# Altium project SynchroLightMaster_V2.PrjPcb
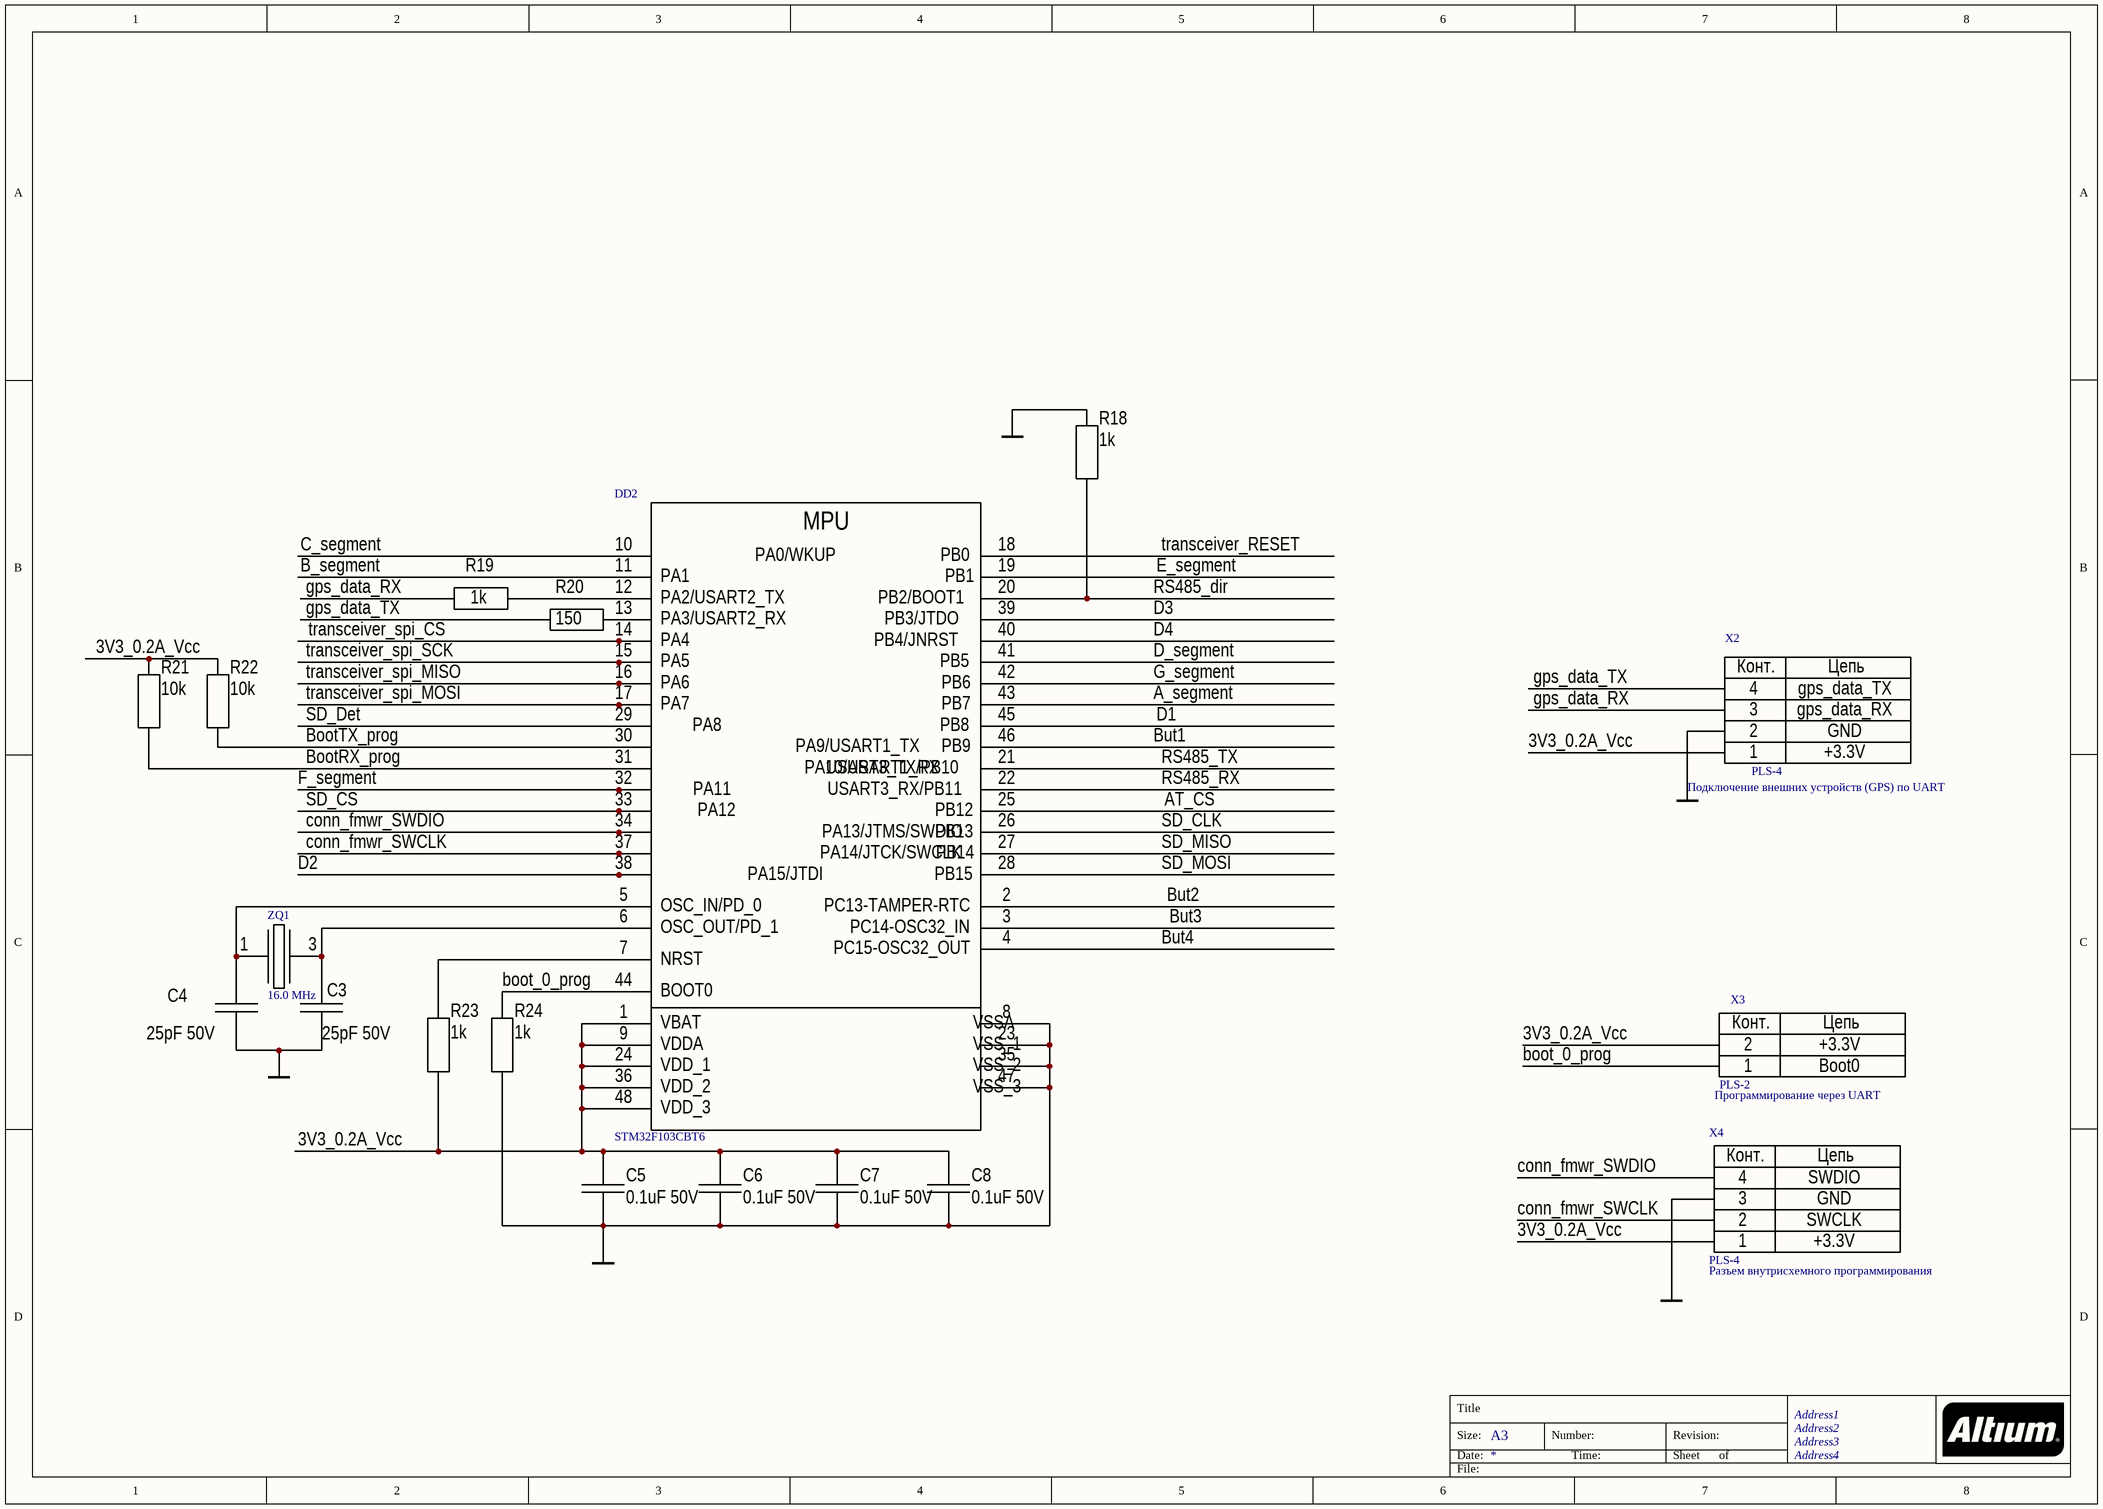
[diagram p0: MCU.SchDoc]
5 sheets, 116 parts. Net scope: global (net labels, ports and power ports of the same name join across sheets).
Board file: SynchroLightMaster_V2.PcbDoc
Sheets:
  MCU.SchDoc
  Transceiver.SchDoc
  RS485_USB.SchDoc
  LCD_SD.SchDoc
  Power.SchDoc

## Sheet MCU.SchDoc
size A3; Address1: Address1; Address2: Address2; Address3: Address3; Address4: Address4

### Parts
C3  25pF 50V  [0805_CAP]
C4  25pF 50V  [0805_CAP]
C5  0.1uF 50V  [0805_CAP]
C6  0.1uF 50V  [0805_CAP]
C7  0.1uF 50V  [0805_CAP]
C8  0.1uF 50V  [0805_CAP]
DD2  STM32F103CBT6  [Lqfp-48]
R18  1k  [0805_RES]
R19  1k  [0805_RES]
R20  150  [0805_RES]
R21  10k  [0805_RES]
R22  10k  [0805_RES]
R23  1k  [0805_RES]
R24  1k  [0805_RES]
X2  PLS-4  Destiny: Подключение внешних устройств (GPS) по UART  [PLS-4-2.54]
X3  PLS-2  Destiny: Программирование через UART  [PLS-2-2.54]
X4  PLS-4  Destiny: Разъем внутрисхемного программирования  [PLS-4-2.54]
ZQ1  16.0 MHz  [HC-49]

### Nets
GND: C3.1 C4.1 C5.1 C6.1 C7.1 C8.1 DD2.8 DD2.23 DD2.35 DD2.47 R18.2 R24.1 X2.2 X4.3
3V3_0.2A_Vcc: C5.2 C6.2 C7.2 C8.2 DD2.1 DD2.9 DD2.24 DD2.36 DD2.48 R21.2 R22.2 R23.1 X2.1 X3.2 X4.1
A_segment: DD2.43
AT_CS: DD2.25
B_segment: DD2.11
boot_0_prog: DD2.44 R24.2 X3.1
BootRX_prog: DD2.31 R21.1
BootTX_prog: DD2.30 R22.1
But1: DD2.46
But2: DD2.2
But3: DD2.3
But4: DD2.4
C_segment: DD2.10
conn_fmwr_SWCLK: DD2.37 X4.2
conn_fmwr_SWDIO: DD2.34 X4.4
D1: DD2.45
D2: DD2.38
D3: DD2.39
D4: DD2.40
D_segment: DD2.41
E_segment: DD2.19
F_segment: DD2.32
G_segment: DD2.42
gps_data_RX: R19.2 X2.3
gps_data_TX: R20.2 X2.4
RS485_dir: DD2.20 R18.1
RS485_RX: DD2.22
RS485_TX: DD2.21
SD_CLK: DD2.26
SD_CS: DD2.33
SD_Det: DD2.29
SD_MISO: DD2.27
SD_MOSI: DD2.28
transceiver_RESET: DD2.18
transceiver_spi_CS: DD2.14
transceiver_spi_MISO: DD2.16
transceiver_spi_MOSI: DD2.17
transceiver_spi_SCK: DD2.15
NetC3_2: C3.2 DD2.6 ZQ1.3
NetC4_2: C4.2 DD2.5 ZQ1.1
NetDD2_7: DD2.7 R23.2
NetDD2_12: DD2.12 R19.1
NetDD2_13: DD2.13 R20.1

### Notes on the sheet
- Title
- Size:
- Date:
- A3
- Number:
- Time:
- Revision:
- Sheet
- of
- File:
- (in symbol 2pin_conn) Конт.; Цепь
- (in symbol 4pin_conn) Конт.; Цепь
- (in symbol STM32F103-48) MPU; PA0/WKUP; PB0; PA1; PB1; PA2/USART2_TX; PB2/BOOT1; PA3/USART2_RX; PB3/JTDO; PA4; PB4/JNRST; PA5; PB5; PA6; PB6; PA7; PB7; PA8; PB8; PA9/USART1_TX; PB9; PA10/USART1_RX; USART3_TX/PB10; PA11; USART3_RX/PB11; PA12; PB12; PA13/JTMS/SWDIO; PB13; PA14/JTCK/SWCLK; PB14; PA15/JTDI; PB15; OSC_IN/PD_0; PC13-TAMPER-RTC; OSC_OUT/PD_1; PC14-OSC32_IN; PC15-OSC32_OUT; NRST; BOOT0; VBAT; VSSA; VDDA; VSS_1; VDD_1; VSS_2; VDD_2; VSS_3; VDD_3

### Library data of the parts
C3-C8 = Cap_np
  C3 C4: Value: 25pF 50V
  C5-C8: Value: 0.1uF 50V
DD2 = STM32F103-48: Value: STM32F103CBT6
R18-R24 = Res
  R18 R19 R23 R24: Value: 1k
  R20: Value: 150
  R21 R22: Value: 10k
X2 = 4pin_conn: PinName1: +3.3V; PinName2: GND; PinName3: gps_data_RX; PinName4: gps_data_TX; Value: PLS-4
X3 = 2pin_conn: PinName2: +3.3V; PinName1: Boot0; Value: PLS-2
X4 = 4pin_conn: PinName1: +3.3V; PinName2: SWCLK; PinName3: GND; PinName4: SWDIO; Value: PLS-4
ZQ1 = Cristall: Value: 16.0 MHz

## Sheet Transceiver.SchDoc
size A3; Address1: Address1; Address2: Address2; Address3: Address3; Address4: Address4
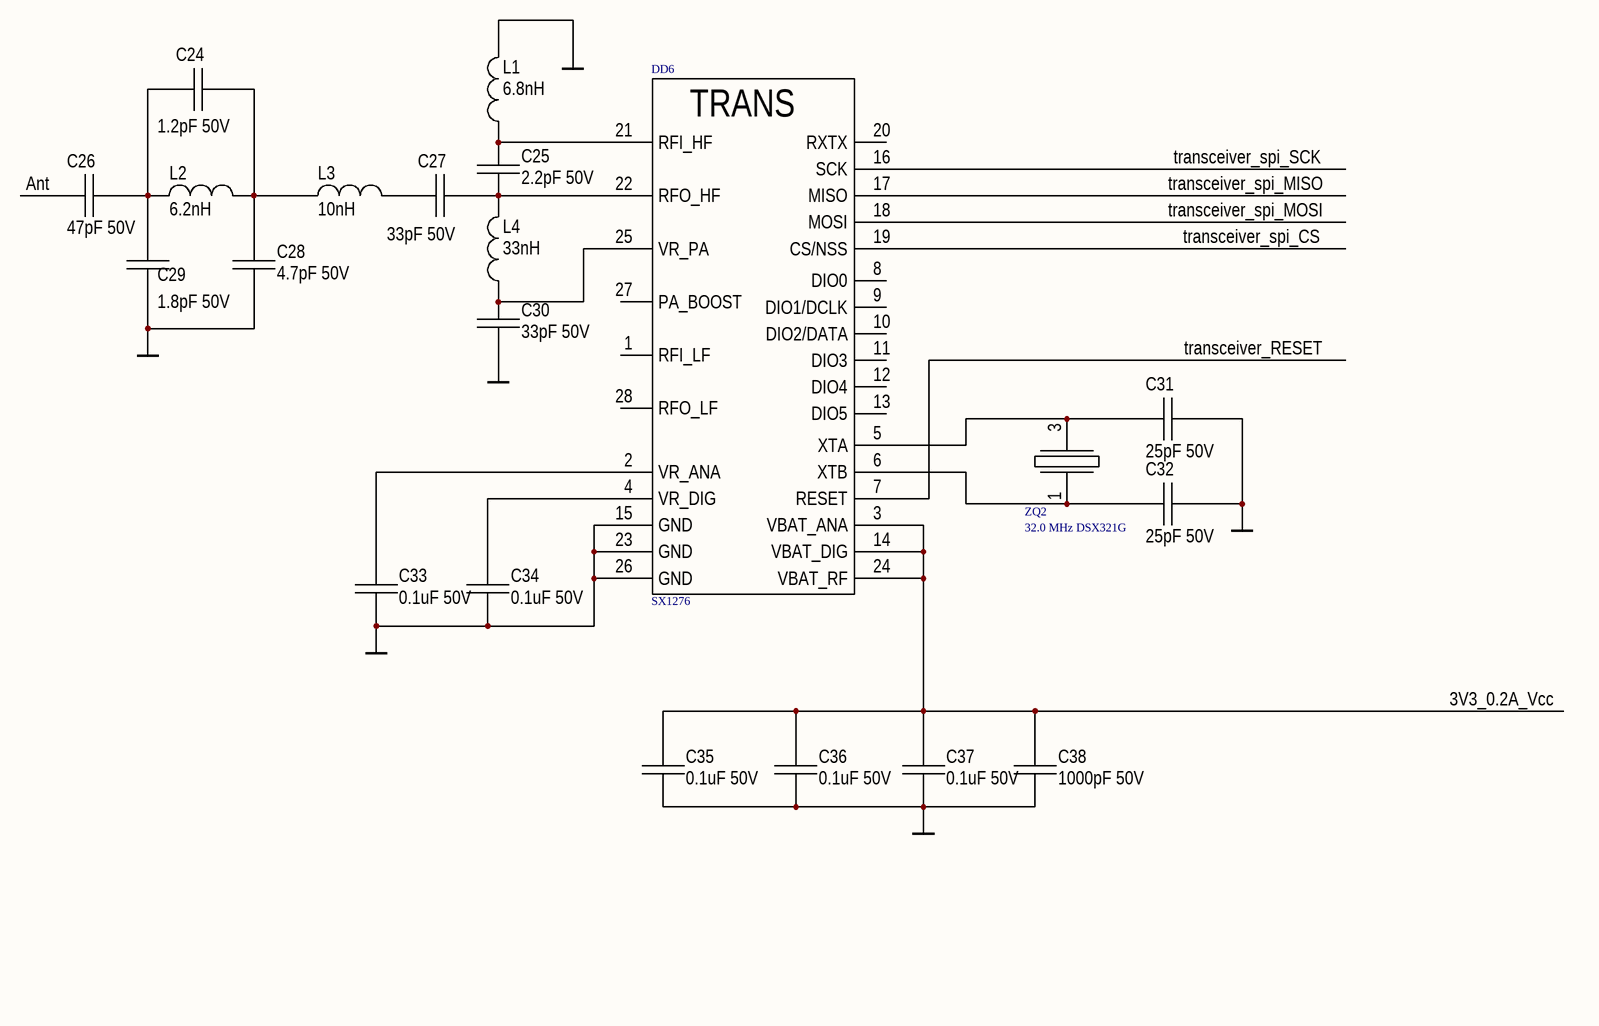
[diagram p1: Transceiver.SchDoc]

### Parts
C24  1.2pF 50V  [0603_CAP]
C25  2.2pF 50V  [0603_CAP]
C26  47pF 50V  [0603_CAP]
C27  33pF 50V  [0603_CAP]
C28  4.7pF 50V  [0603_CAP]
C29  1.8pF 50V  [0603_CAP]
C30  33pF 50V  [0603_CAP]
C31  25pF 50V  [0805_CAP]
C32  25pF 50V  [0805_CAP]
C33  0.1uF 50V  [0805_CAP]
C34  0.1uF 50V  [0805_CAP]
C35  0.1uF 50V  [0805_CAP]
C36  0.1uF 50V  [0805_CAP]
C37  0.1uF 50V  [0805_CAP]
C38  1000pF 50V  [0805_CAP]
DD6  SX1276  [qfn28]
L1  6.8nH  [0603_ind]
L2  6.2nH  [0603_ind]
L3  10nH  [0603_ind]
L4  33nH  [0603_ind]
ZQ2  32.0 MHz DSX321G  [gtxo-93]

### Nets
GND: C28.2 C29.1 C30.2 C31.2 C32.2 C33.1 C34.2 C35.2 C36.2 C37.2 C38.2 DD6.15(GND) DD6.23(GND) DD6.26(GND) L1.2
3V3_0.2A_Vcc: C35.1 C36.1 C37.1 C38.1 DD6.3(VBAT_ANA) DD6.14(VBAT_DIG) DD6.24(VBAT_RF)
Ant: C26.2
transceiver_RESET: DD6.7(RESET)
transceiver_spi_CS: DD6.19(CS/NSS)
transceiver_spi_MISO: DD6.17(MISO)
transceiver_spi_MOSI: DD6.18(MOSI)
transceiver_spi_SCK: DD6.16(SCK)
NetC24_1: C24.1 C26.1 C29.2 L2.1
NetC24_2: C24.2 C28.1 L2.2 L3.1
NetC25_1: C25.1 C27.1 DD6.22(RFO_HF) L4.2
NetC25_2: C25.2 DD6.21(RFI_HF) L1.1
NetC27_2: C27.2 L3.2
NetC30_1: C30.1 DD6.25(VR_PA) L4.1
NetC31_1: C31.1 DD6.5(XTA) ZQ2.3
NetC32_1: C32.1 DD6.6(XTB) ZQ2.1
NetC33_2: C33.2 DD6.2(VR_ANA)
NetC34_1: C34.1 DD6.4(VR_DIG)

Not connected (* = marked no-connect by the designer): DD6 1(RFI_LF) 8(DIO0) 9(DIO1/DCLK) 10(DIO2/DATA) 11(DIO3) 12(DIO4) 13(DIO5) 20(RXTX) 27(PA_BOOST) 28(RFO_LF)

### Notes on the sheet
- На место компонента С6 запаивается перемычка
- Title
- Size:
- Date:
- A3
- Number:
- Time:
- Revision:
- Sheet
- of
- File:
- (in symbol SX1276) TRANS

### Library data of the parts
C24-C38 = Cap_np
  C24: Value: 1.2pF 50V
  C25: Value: 2.2pF 50V
  C26: Value: 47pF 50V
  C27 C30: Value: 33pF 50V
  C28: Value: 4.7pF 50V
  C29: Value: 1.8pF 50V
  C31 C32: Value: 25pF 50V
  C33-C37: Value: 0.1uF 50V
  C38: Value: 1000pF 50V
L1-L4 = Inductor
  L1: Value: 6.8nH
  L2: Value: 6.2nH
  L3: Value: 10nH
  L4: Value: 33nH
ZQ2 = Cristall: Value: 32.0 MHz DSX321G
DD6 = SX1276: Value: SX1276

## Sheet RS485_USB.SchDoc
size A3; Address1: Address1; Address2: Address2; Address3: Address3; Address4: Address4
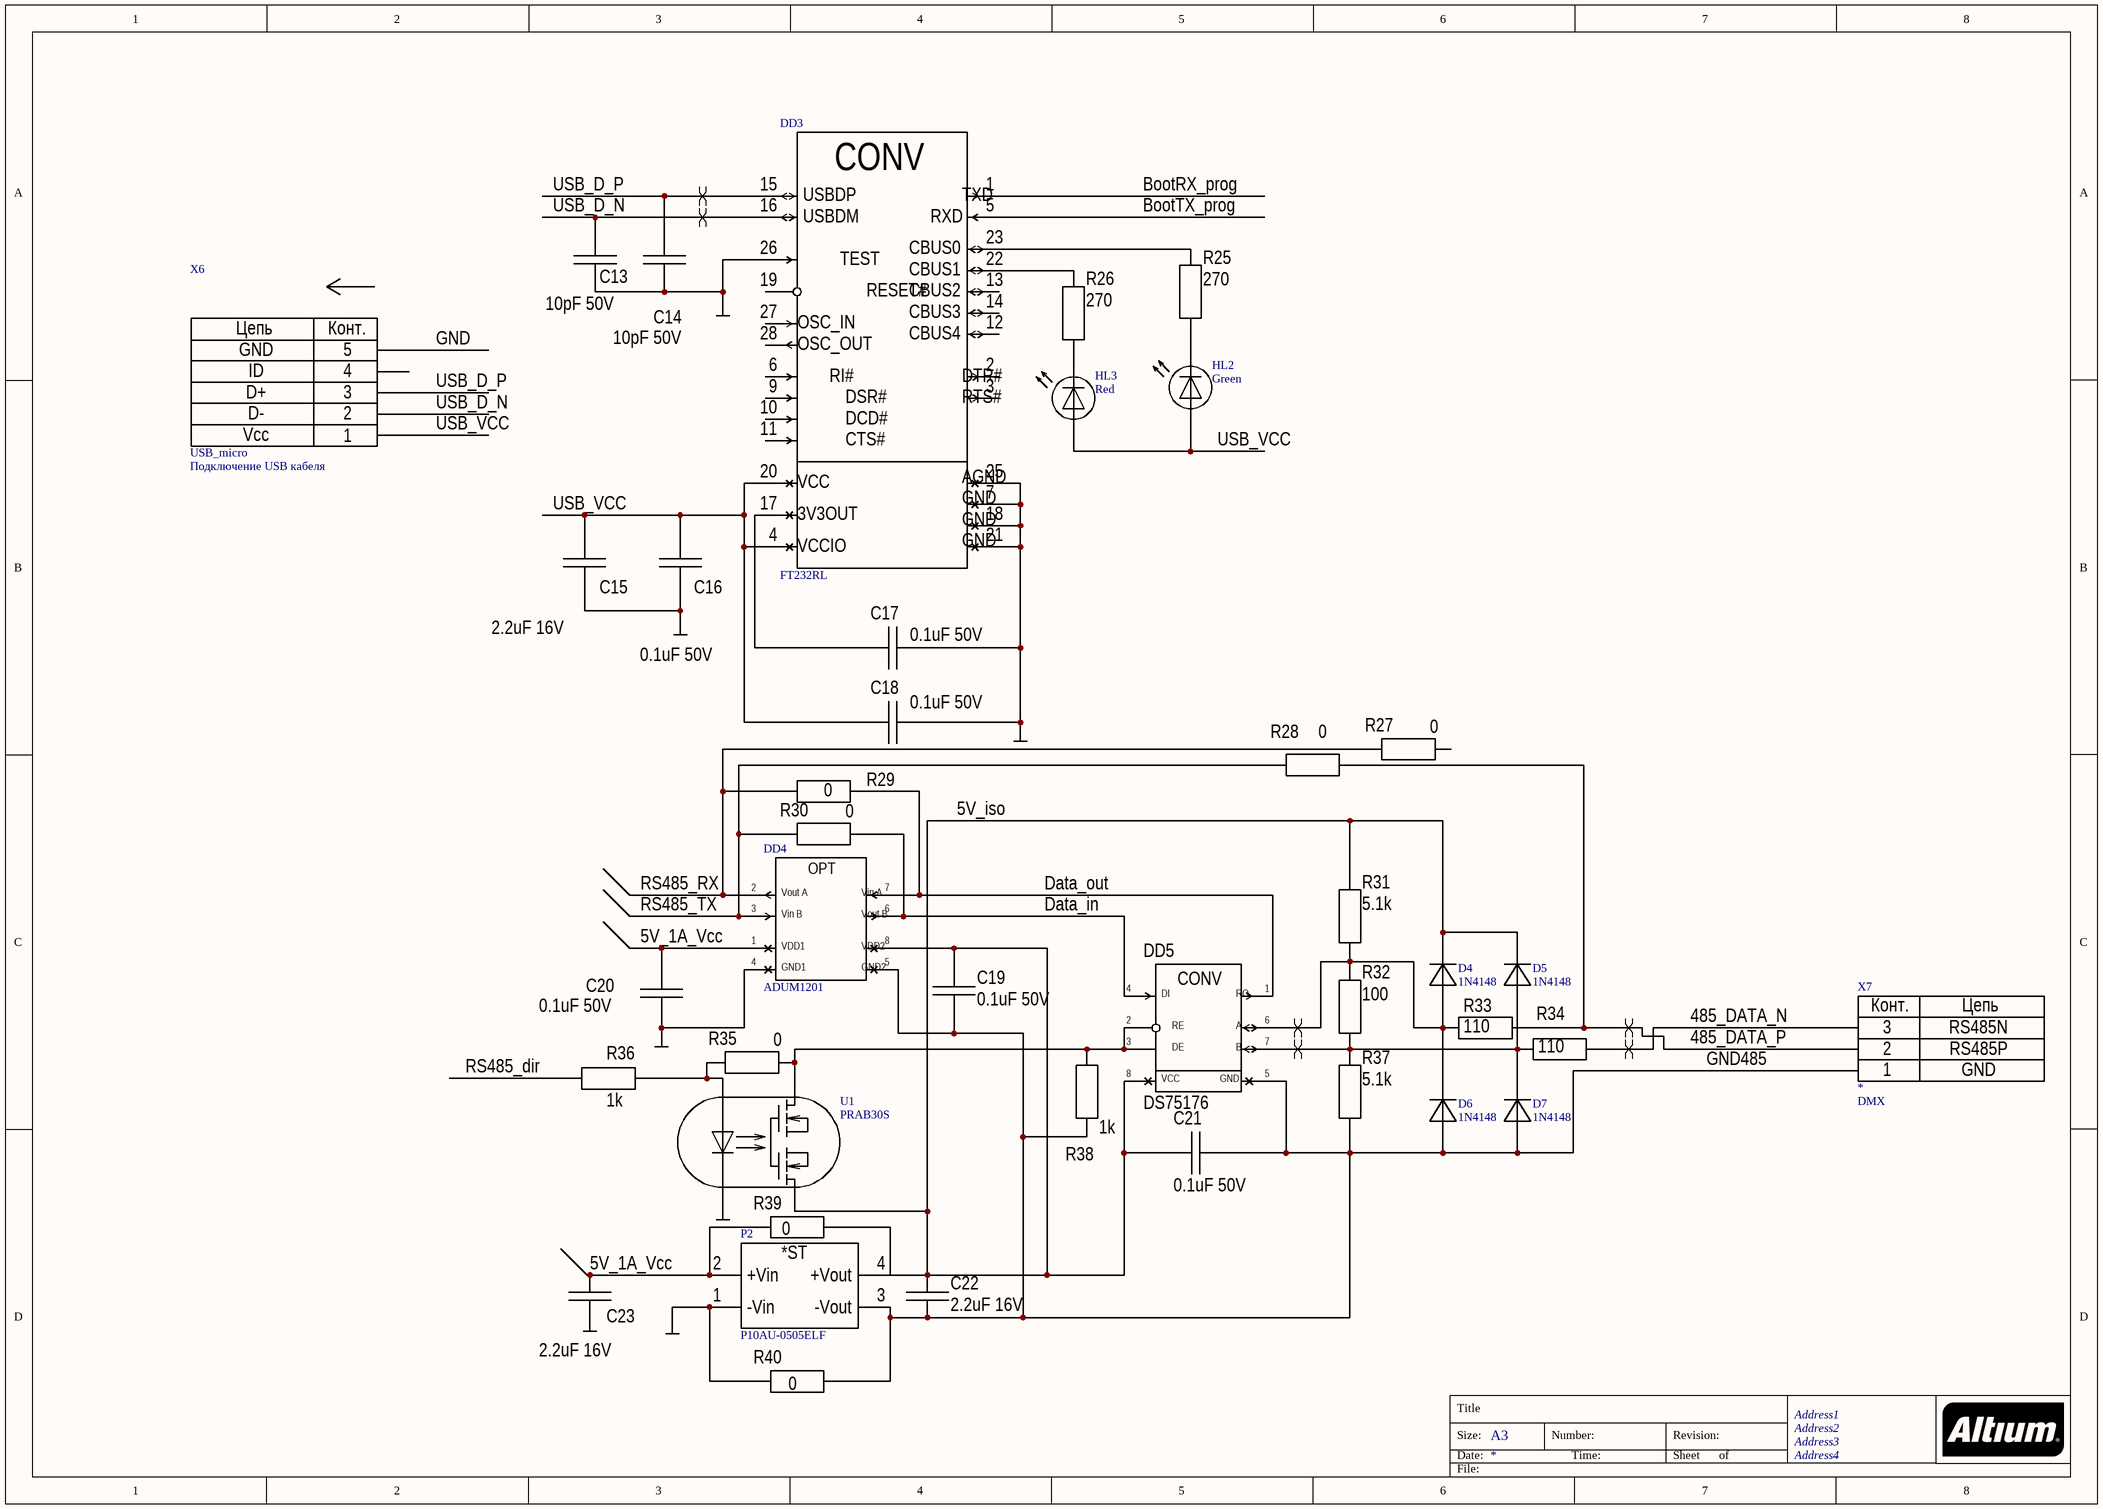
[diagram p2: RS485_USB.SchDoc]

### Parts
C13  10pF 50V  [0805_CAP]
C14  10pF 50V  [0805_CAP]
C15  2.2uF 16V  [0805_CAP]
C16  0.1uF 50V  [0805_CAP]
C17  0.1uF 50V  [0805_CAP]
C18  0.1uF 50V  [0805_CAP]
C19  0.1uF 50V  [0805_CAP]
C20  0.1uF 50V  [0805_CAP]
C21  0.1uF 50V  [0805_CAP]
C22  2.2uF 16V  [0805_CAP]
C23  2.2uF 16V  [0805_CAP]
D4  1N4148  [sod80c]
D5  1N4148  [sod80c]
D6  1N4148  [sod80c]
D7  1N4148  [sod80c]
DD3  FT232RL  [SSOP28]
DD4  ADUM1201  [soic-8]
DD5  DS75176  [soic-8]
HL2  Green  [0603_led_ipc]
HL3  Red  [0603_led_ipc]
P2  P10AU-0505ELF  [SIP4]
R25  270  [0805_RES]
R26  270  [0805_RES]
R27  0  [0805_RES]
R28  0  [0805_RES]
R29  0  [0805_RES]
R30  0  [0805_RES]
R31  5.1k  [0805_RES]
R32  100  [0805_RES]
R33  110  [0805_RES]
R34  110  [0805_RES]
R35  0  [0805_RES]
R36  1k  [0805_RES]
R37  5.1k  [0805_RES]
R38  1k  [0805_RES]
R39  0  [0805_RES]
R40  0  [0805_RES]
U1  PRAB30S  [sop4_optocoup]
X6  USB_micro  Назначение: Подключение USB кабеля  [usb_micro]
X7  *  Destiny: DMX  [3pad_5.08]

### Nets
GND: C13.1 C14.1 C15.1 C16.1 C17.1 C18.1 C20.2 C23.1 DD3.7 DD3.18 DD3.21 DD3.25 DD3.26 DD4.4 P2.1(-Vin) R40.1 U1.2(C) X6.5
5V_1A_Vcc: C20.1 C23.2 DD4.1(A1) P2.2(+Vin) R39.1
5V_iso: C19.1 C21.1 C22.2 D4.2 D5.2 DD4.8 DD5.8 P2.4(+Vout) R31.1 R39.2 U1.3(E)
485_DATA_N: R34.2 X7.3
485_DATA_P: R28.2 R33.2 X7.2
BootRX_prog: DD3.1
BootTX_prog: DD3.5
Data_in: DD4.6 DD5.4 R30.2
Data_out: DD4.7 DD5.1 R29.2
GND485: C19.2 C21.2 C22.1 D6.1 D7.1 DD4.5 DD5.5 P2.3(-Vout) R37.2 R38.2 R40.2 X7.1
RS485_dir: R36.1
RS485_RX: DD4.2 R27.1 R29.1
RS485_TX: DD4.3 R28.1 R30.1
USB_D_N: C13.2 DD3.16 X6.2
USB_D_P: C14.2 DD3.15 X6.3
USB_VCC: C15.2 C16.2 C18.2 DD3.4 DD3.20 HL2.1 HL3.1 X6.1
NetC17_2: C17.2 DD3.17
NetD4_1: D4.1 D6.2 DD5.6 R31.2 R32.1 R33.1
NetD5_1: D5.1 D7.2 DD5.7 R32.2 R34.1 R37.1
NetDD3_22: DD3.22 R26.2
NetDD3_23: DD3.23 R25.2
NetDD5_2: DD5.2 DD5.3 R35.2 R38.1 U1.4(C)
NetHL2_2: HL2.2 R25.1
NetHL3_2: HL3.2 R26.1
NetR35_1: R35.1 R36.2 U1.1(A)

Not connected (* = marked no-connect by the designer): DD3 2 3 6 9 10 11 12 13 14 19 27 28; R27 2; X6 4

### Layout directives
differential pair: 485_DATA_N, 485_DATA_P, NetD4_1, NetD5_1, USB_D_N, USB_D_P

### Notes on the sheet
- Title
- Size:
- Date:
- A3
- Number:
- Time:
- Revision:
- Sheet
- of
- File:
- (in symbol 3pin_conn) Конт.; Цепь
- (in symbol ADUM1201) OPT; Vout A; Vin A; Vin B; Vout B; VDD1; VDD2; GND1; GND2
- (in symbol ds75176) CONV; DI; RO; RE; A; DE; B; VCC; GND
- (in symbol FT232RL) CONV; USBDP; TXD; USBDM; RXD; CBUS0; TEST; CBUS1; RESET#; CBUS2; CBUS3; OSC_IN; CBUS4; OSC_OUT; RI#; DTR#; DSR#; RTS#; DCD#; CTS#; VCC; AGND; GND; 3V3OUT; VCCIO
- (in symbol P10AU) *ST
- (in symbol USB_micro) Цепь; Конт.; GND; ID; D+; D-; Vcc

### Library data of the parts
C13-C23 = Cap_np
  C13 C14: Value: 10pF 50V
  C15 C22 C23: Value: 2.2uF 16V
  C16-C21: Value: 0.1uF 50V
D4-D7 = Diode: Value: 1N4148
HL2 HL3 = led
  HL2: Value: Green
  HL3: Value: Red
P2 = P10AU: Value: P10AU-0505ELF
R25-R40 = Res
  R25 R26: Value: 270
  R27-R30 R35 R39 R40: Value: 0
  R31 R37: Value: 5.1k
  R32: Value: 100
  R33 R34: Value: 110
  R36 R38: Value: 1k
U1 = Opto_Realy: Value: PRAB30S
X7 = 3pin_conn: PinName1: GND; PinName2: RS485P; PinName3: RS485N; Value: *
DD3 = FT232RL: Value: FT232RL
DD4 = ADUM1201: Value: ADUM1201
DD5 = ds75176: Value: DS75176
X6 = USB_micro: Value: USB_micro

## Sheet LCD_SD.SchDoc
size A3; Address1: Address1; Address2: Address2; Address3: Address3; Address4: Address4
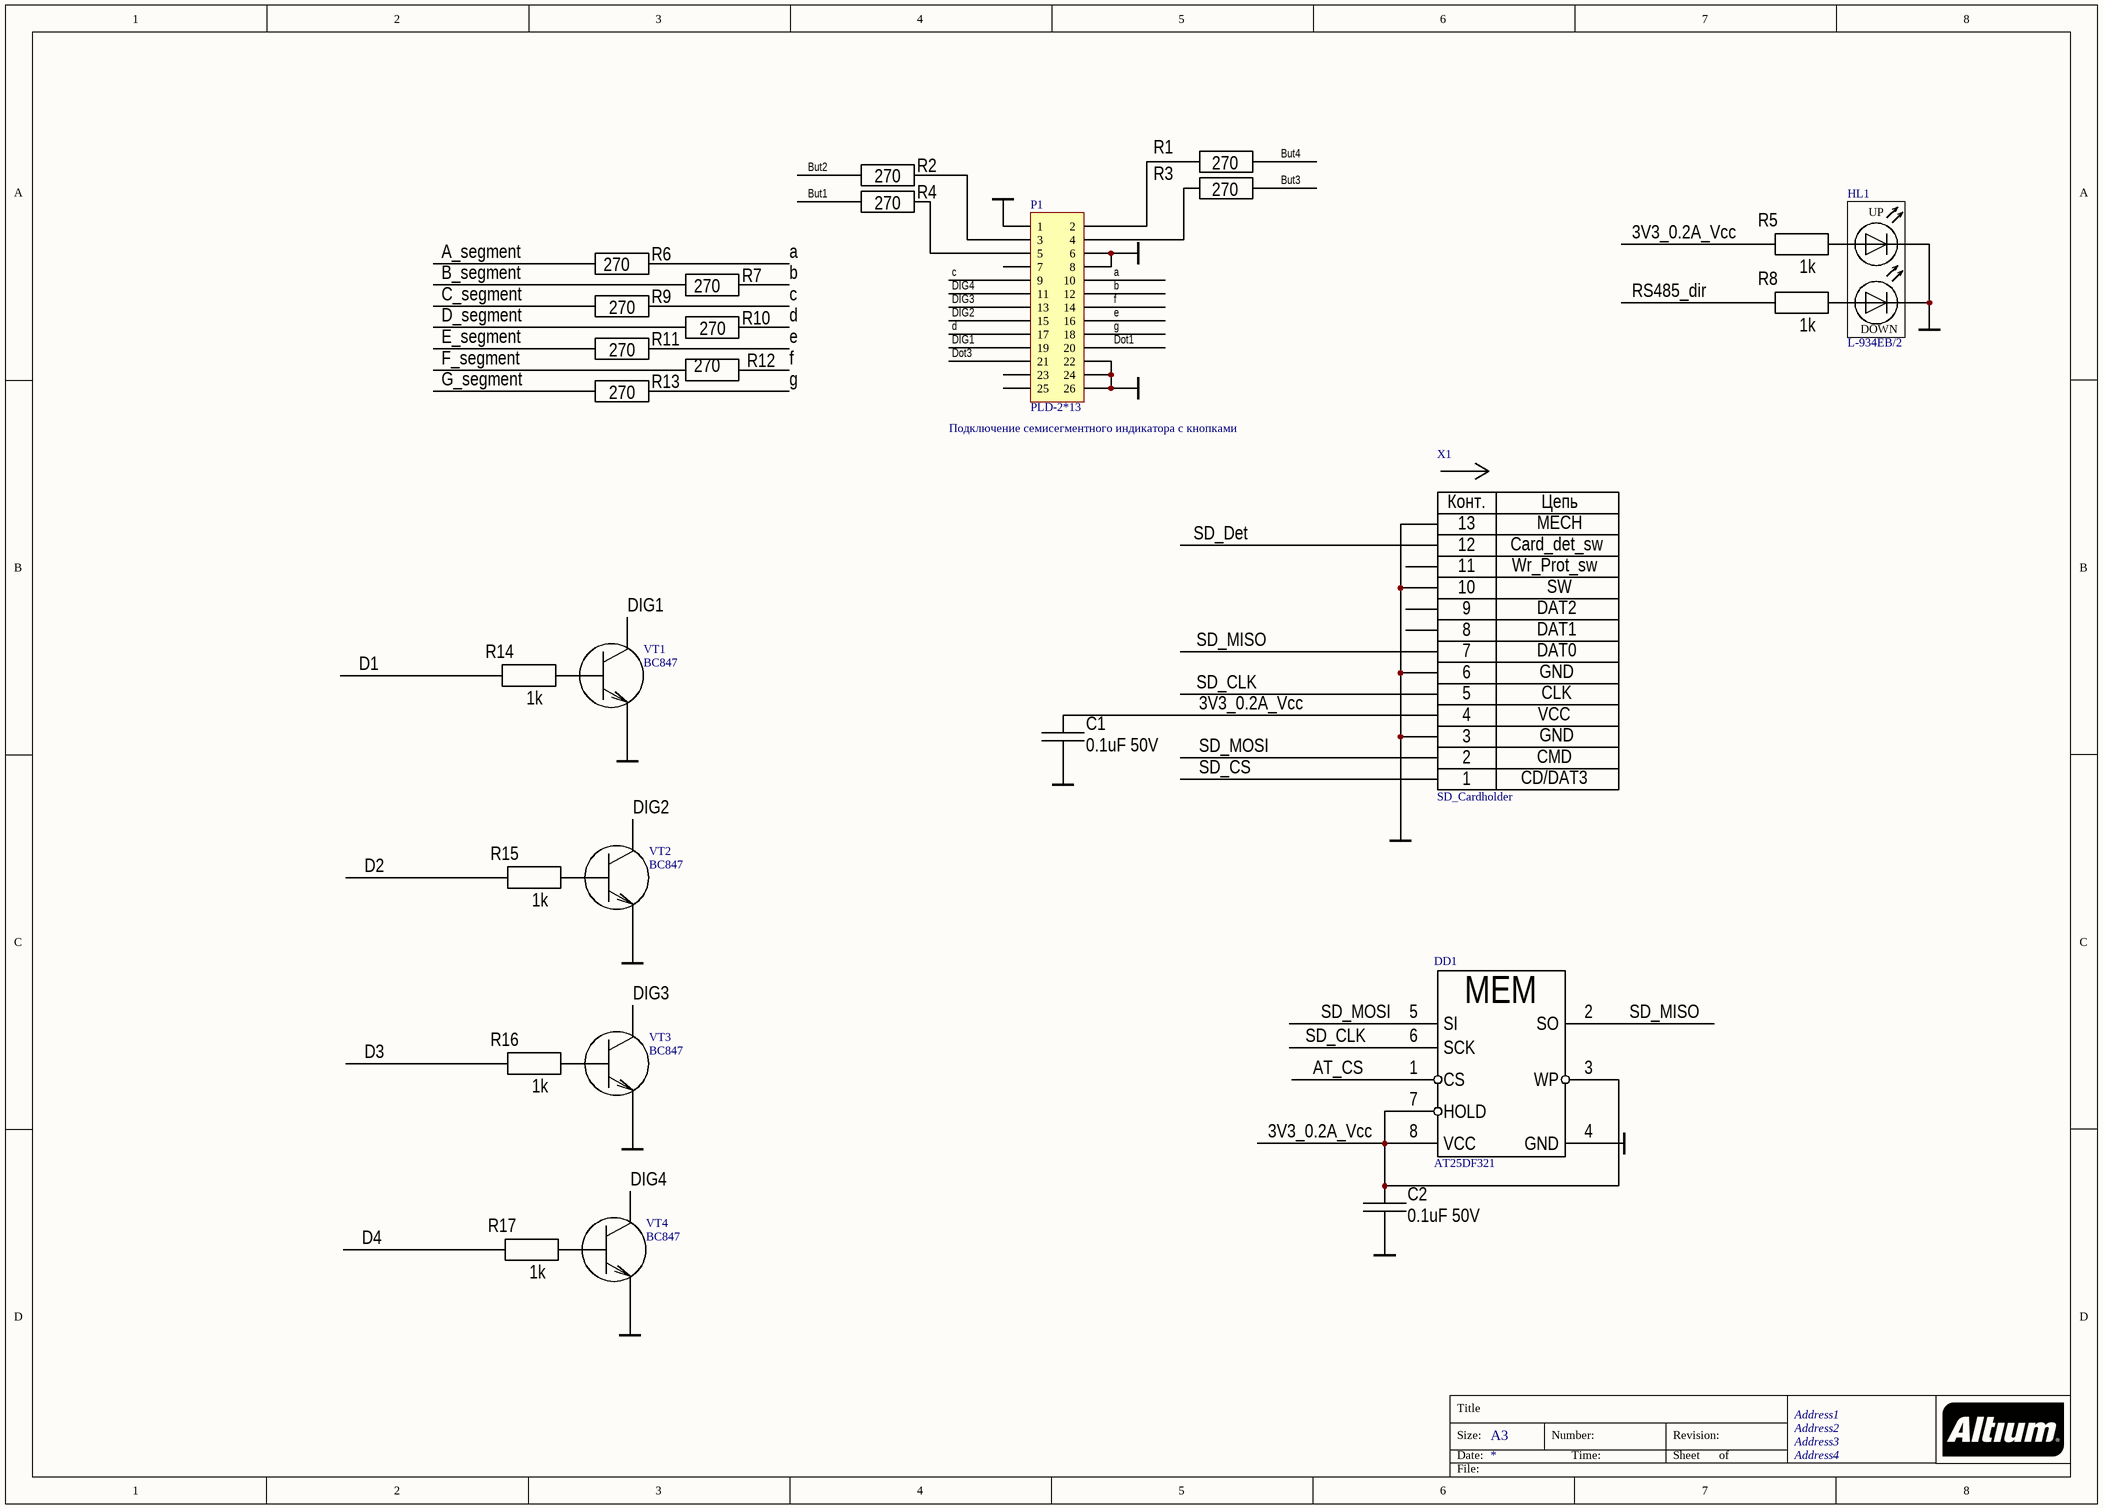
[diagram p3: LCD_SD.SchDoc]

### Parts
C1  0.1uF 50V  [0805_CAP]
C2  0.1uF 50V  [0805_CAP]
DD1  AT25DF321  [soic8-200]
HL1  L-934EB/2  [L-934EB/2]
P1  PLD-2*13  Destiny: Подключение семисегментного индикатора с кнопками  [HDR2X13]
R1  270  [0805_RES]
R2  270  [0805_RES]
R3  270  [0805_RES]
R4  270  [0805_RES]
R5  1k  [0805_RES]
R6  270  [0805_RES]
R7  270  [0805_RES]
R8  1k  [0805_RES]
R9  270  [0805_RES]
R10  270  [0805_RES]
R11  270  [0805_RES]
R12  270  [0805_RES]
R13  270  [0805_RES]
R14  1k  [0805_RES]
R15  1k  [0805_RES]
R16  1k  [0805_RES]
R17  1k  [0805_RES]
VT1  BC847  [sot23-3]
VT2  BC847  [sot23-3]
VT3  BC847  [sot23-3]
VT4  BC847  [sot23-3]
X1  SD_Cardholder  [SDcardHolder]

### Nets
GND: C1.2 C2.2 DD1.4(GND) HL1.1 HL1.3 P1.1 P1.6 P1.8 P1.22 P1.24 P1.26 VT1.2(E) VT2.2(E) VT3.2(E) VT4.2(E) X1.3 X1.6 X1.10 X1.13
3V3_0.2A_Vcc: C1.1 C2.1 DD1.3(WP) DD1.7(HOLD) DD1.8(VCC) R5.2 X1.4
a: P1.10 R6.1
A_segment: R6.2
AT_CS: DD1.1(CS)
b: P1.12 R7.1
B_segment: R7.2
But1: R4.2
But2: R2.2
But3: R3.2
But4: R1.2
c: P1.9 R9.1
C_segment: R9.2
d: P1.17 R10.1
D1: R14.2
D2: R15.2
D3: R16.2
D4: R17.2
D_segment: R10.2
DIG1: P1.19 VT1.3(C)
DIG2: P1.15 VT2.3(C)
DIG3: P1.13 VT3.3(C)
DIG4: P1.11 VT4.3(C)
Dot1: P1.20
Dot3: P1.21
e: P1.16 R11.1
E_segment: R11.2
f: P1.14 R12.1
F_segment: R12.2
g: P1.18 R13.1
G_segment: R13.2
RS485_dir: R8.2
SD_CLK: DD1.6(SCK) X1.5
SD_CS: X1.1
SD_Det: X1.12
SD_MISO: DD1.2(SO) X1.7
SD_MOSI: DD1.5(SI) X1.2
NetHL1_2: HL1.2 R8.1
NetHL1_4: HL1.4 R5.1
NetP1_2: P1.2 R1.1
NetP1_3: P1.3 R2.1
NetP1_4: P1.4 R3.1
NetP1_5: P1.5 R4.1
NetR14_1: R14.1 VT1.1(B)
NetR15_1: R15.1 VT2.1(B)
NetR16_1: R16.1 VT3.1(B)
NetR17_1: R17.1 VT4.1(B)

Not connected (* = marked no-connect by the designer): P1 7 23 25; X1 8 9 11

### Notes on the sheet
- Title
- Size:
- Date:
- A3
- Number:
- Time:
- Revision:
- Sheet
- of
- File:
- (in symbol AT25DF321) MEM
- (in symbol LEDx2) UP; DOWN
- (in symbol SD_Cardholder) Конт.; Цепь; MECH; Card_det_sw; Wr_Prot_sw; SW; DAT2; DAT1; DAT0; GND; CLK; VCC; CMD; CD/DAT3

### Library data of the parts
C1 C2 = Cap_np: Value: 0.1uF 50V
HL1 = LEDx2: Value: L-934EB/2
P1 = Header 13X2: Header, 13-Pin, Dual row; Value: PLD-2*13
R1-R17 = Res
  R1-R4 R6 R7 R9-R13: Value: 270
  R5 R8 R14-R17: Value: 1k
VT1-VT4 = transistor_npn: Value: BC847
DD1 = AT25DF321: Value: AT25DF321
X1 = SD_Cardholder: Value: SD_Cardholder

## Sheet Power.SchDoc
size A4
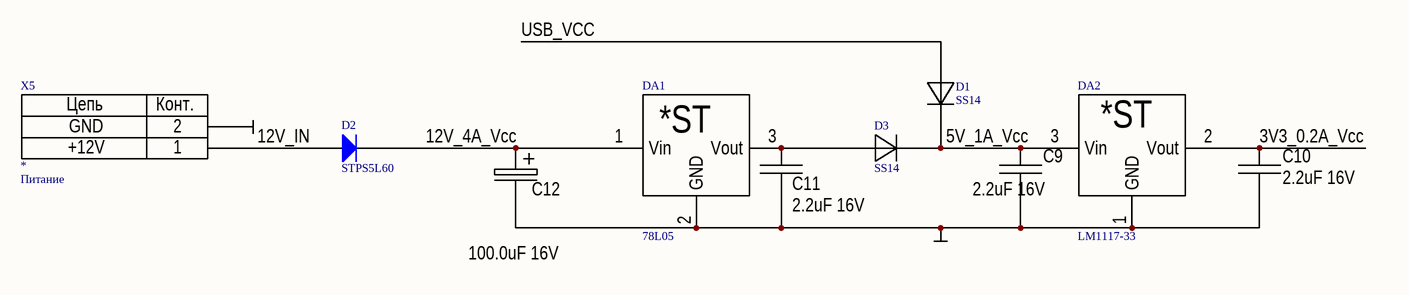
[diagram p4: Power.SchDoc]

### Parts
C9  2.2uF 16V  [0805_CAP]
C10  2.2uF 16V  [0805_CAP]
C11  2.2uF 16V  [0805_CAP]
C12  100.0uF 16V  [CAP_P_8mm_3.5mm]
D1  SS14  [SMA_diode]
D2  STPS5L60  [SMC]
D3  SS14  [SMA_diode]
DA1  78L05  [to-220ab]
DA2  LM1117-33  [dpack]
X5  *  Destiny: Питание  [2pin_5.08]

### Nets
GND: C9.1 C10.1 C11.1 C12.2 DA1.2(GND) DA2.1(GND) X5.2
3V3_0.2A_Vcc: C10.2 DA2.2(Vout)
5V_1A_Vcc: C9.2 D1.2 D3.2 DA2.3(Vin)
12V_4A_Vcc: C12.1 D2.2(K) DA1.1(Vin)
12V_IN: D2.1(A) X5.1
USB_VCC: D1.1
NetC11_2: C11.2 D3.1 DA1.3(Vout)

### Notes on the sheet
- (in symbol 2pin_conn) Цепь; Конт.
- (in symbol 78L05) *ST
- (in symbol LM1117) *ST

### Library data of the parts
C9-C11 = Cap_np: Value: 2.2uF 16V
C12 = Cap_p: Group: Passive; Value: 100.0uF 16V
D1 D3 = Diode: Value: SS14
D2 = Diode: Default Diode; Published: 8-Jun-2000; LatestRevisionDate: 17-Jul-2002; LatestRevisionNote: Re-released for DXP Platform.; PackageVersion: Sep-1996; PackageReference: SMC; Publisher: Altium Limited; PackageDescription: DO-214-AB/SMC; 2 C-Bend Leads; Body 7.9 x 5.9 mm, inc. leads (LxW); Code_JEDEC: DO-214-AB
DA2 = LM1117: Value: LM1117-33
X5 = 2pin_conn: PinName2: GND; PinName1: +12V; Value: *
DA1 = 78L05: Value: 78L05

## Nets that join several sheets
GND: MCU (14 pins), Transceiver (15 pins), RS485_USB (18 pins), LCD_SD (19 pins), Power (7 pins)
3V3_0.2A_Vcc: MCU (15 pins), Transceiver (7 pins), LCD_SD (7 pins), Power (C10.2 DA2.2)
5V_1A_Vcc: RS485_USB (5 pins), Power (C9.2 D1.2 D3.2 DA2.3)
A_segment: MCU (DD2.43), LCD_SD (R6.2)
AT_CS: MCU (DD2.25), LCD_SD (DD1.1)
B_segment: MCU (DD2.11), LCD_SD (R7.2)
BootRX_prog: MCU (DD2.31 R21.1), RS485_USB (DD3.1)
BootTX_prog: MCU (DD2.30 R22.1), RS485_USB (DD3.5)
But1: MCU (DD2.46), LCD_SD (R4.2)
But2: MCU (DD2.2), LCD_SD (R2.2)
But3: MCU (DD2.3), LCD_SD (R3.2)
But4: MCU (DD2.4), LCD_SD (R1.2)
C_segment: MCU (DD2.10), LCD_SD (R9.2)
D1: MCU (DD2.45), LCD_SD (R14.2)
D2: MCU (DD2.38), LCD_SD (R15.2)
D3: MCU (DD2.39), LCD_SD (R16.2)
D4: MCU (DD2.40), LCD_SD (R17.2)
D_segment: MCU (DD2.41), LCD_SD (R10.2)
E_segment: MCU (DD2.19), LCD_SD (R11.2)
F_segment: MCU (DD2.32), LCD_SD (R12.2)
G_segment: MCU (DD2.42), LCD_SD (R13.2)
RS485_dir: MCU (DD2.20 R18.1), RS485_USB (R36.1), LCD_SD (R8.2)
RS485_RX: MCU (DD2.22), RS485_USB (DD4.2 R27.1 R29.1)
RS485_TX: MCU (DD2.21), RS485_USB (DD4.3 R28.1 R30.1)
SD_CLK: MCU (DD2.26), LCD_SD (DD1.6 X1.5)
SD_CS: MCU (DD2.33), LCD_SD (X1.1)
SD_Det: MCU (DD2.29), LCD_SD (X1.12)
SD_MISO: MCU (DD2.27), LCD_SD (DD1.2 X1.7)
SD_MOSI: MCU (DD2.28), LCD_SD (DD1.5 X1.2)
transceiver_RESET: MCU (DD2.18), Transceiver (DD6.7)
transceiver_spi_CS: MCU (DD2.14), Transceiver (DD6.19)
transceiver_spi_MISO: MCU (DD2.16), Transceiver (DD6.17)
transceiver_spi_MOSI: MCU (DD2.17), Transceiver (DD6.18)
transceiver_spi_SCK: MCU (DD2.15), Transceiver (DD6.16)
USB_VCC: RS485_USB (8 pins), Power (D1.1)